# Altium schematic sheet STM32F051.SchDoc
size A4
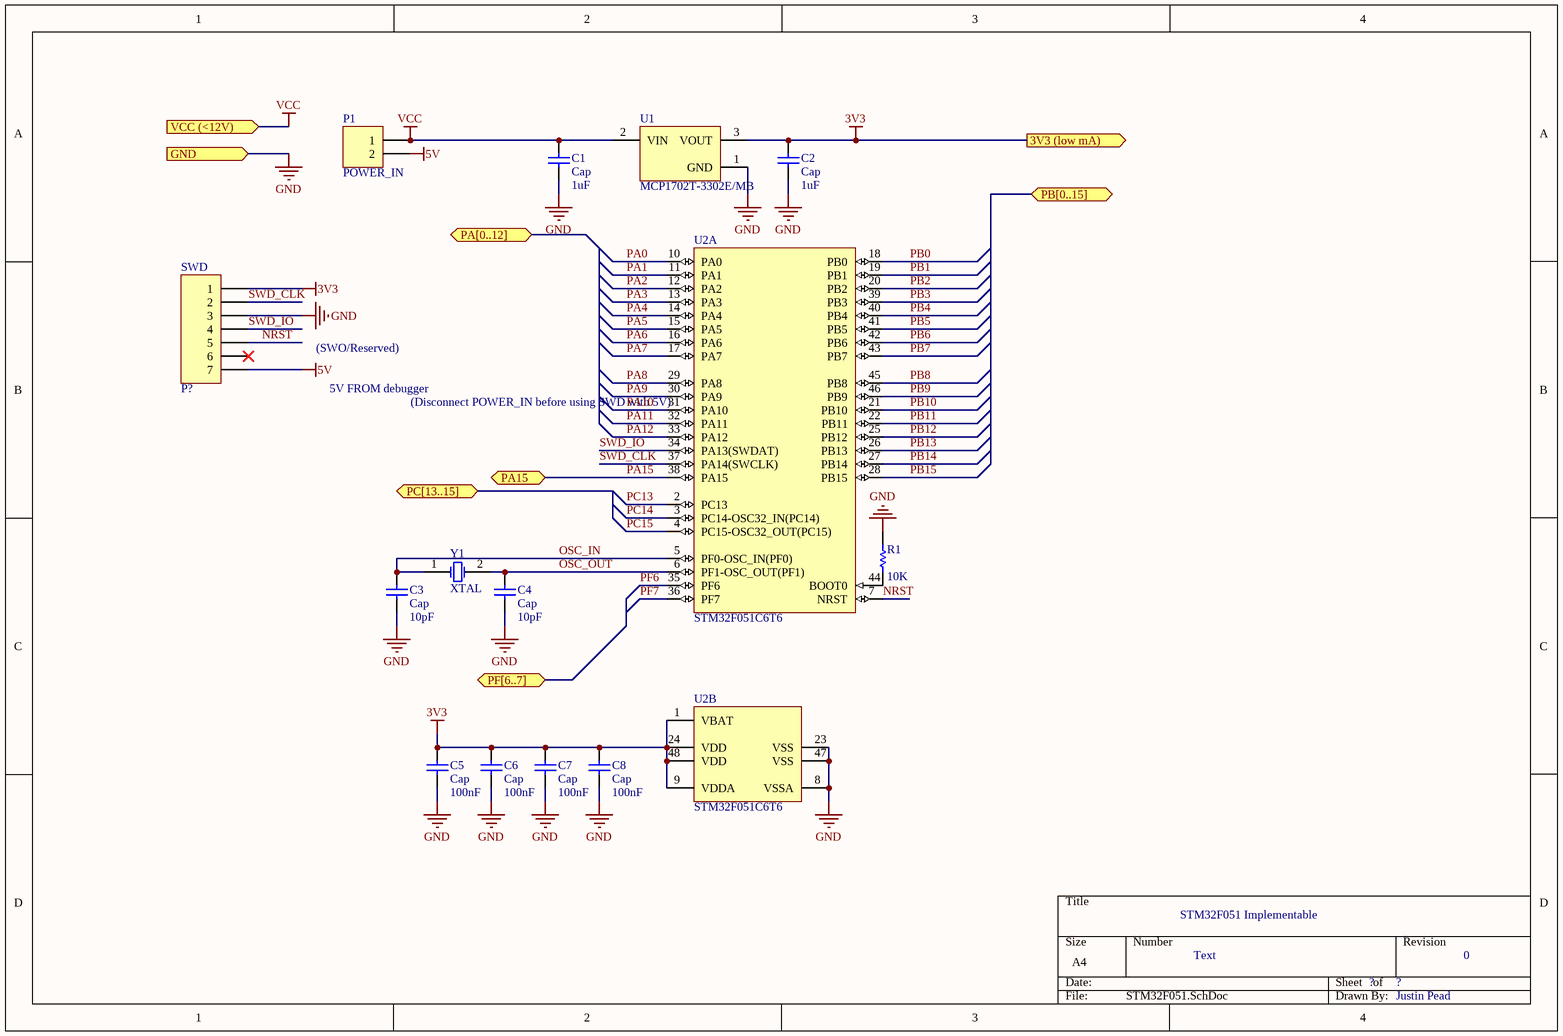
[diagram p0: STM32F051.SchDoc]

## Parts
C1  Cap  value 1uF  [0805_JG]
C2  Cap  value 1uF  [0805_JG]
C3  Cap  value 10pF  [0805_JG]
C4  Cap  value 10pF  [0805_JG]
C5  Cap  value 100nF  [0805_JG]
C6  Cap  value 100nF  [0805_JG]
C7  Cap  value 100nF  [0805_JG]
C8  Cap  value 100nF  [0805_JG]
P1  POWER_IN  [HDR1X2]
R1  value 10K  [0805_JG]  (hidden comment: Res1)
SWD  P?  [HDR1X7]
U1  MCP1702T-3302E/MB  [SOT-89-MB3_M]
U2  STM32F051C6T6  [STM-LQFP48_M]  (parts A,B of 2)
Y1  XTAL  [HC-49US]

## Ports
3V3 (low mA) (out), GND (in), PA15 (bidir), PA[0..12] (bidir), PB[0..15] (bidir), PC[13..15] (bidir), PF[6..7] (bidir), VCC (<12V) (in)

## Nets
3V3: C2.2 C5.2 C6.2 C7.2 C8.2 SWD.1 U1.3(VOUT) U2.1(VBAT) U2.9(VDDA) U2.24(VDD) U2.48(VDD) ; port 3V3 (low mA)
5V: P1.2 SWD.7
GND: C1.1 C2.1 C3.1 C4.1 C5.1 C6.1 C7.1 C8.1 R1.2 SWD.3 U1.1(GND) U2.8(VSSA) U2.23(VSS) U2.47(VSS) ; port GND
VCC: C1.2 P1.1 U1.2(VIN) ; port VCC (<12V)
NRST: SWD.5 U2.7(NRST)
OSC_IN: C3.2 U2.5(PF0-OSC_IN(PF0)) Y1.1(OSC1)
OSC_OUT: C4.2 U2.6(PF1-OSC_OUT(PF1)) Y1.2(OSC2)
PA0: U2.10(PA0)
PA1: U2.11(PA1)
PA2: U2.12(PA2)
PA3: U2.13(PA3)
PA4: U2.14(PA4)
PA5: U2.15(PA5)
PA6: U2.16(PA6)
PA7: U2.17(PA7)
PA8: U2.29(PA8)
PA9: U2.30(PA9)
PA10: U2.31(PA10)
PA11: U2.32(PA11)
PA12: U2.33(PA12)
PA15: U2.38(PA15) ; port PA15
PB0: U2.18(PB0)
PB1: U2.19(PB1)
PB2: U2.20(PB2)
PB3: U2.39(PB3)
PB4: U2.40(PB4)
PB5: U2.41(PB5)
PB6: U2.42(PB6)
PB7: U2.43(PB7)
PB8: U2.45(PB8)
PB9: U2.46(PB9)
PB10: U2.21(PB10)
PB11: U2.22(PB11)
PB12: U2.25(PB12)
PB13: U2.26(PB13)
PB14: U2.27(PB14)
PB15: U2.28(PB15)
PC13: U2.2(PC13)
PC14: U2.3(PC14-OSC32_IN(PC14))
PC15: U2.4(PC15-OSC32_OUT(PC15))
PF6: U2.35(PF6)
PF7: U2.36(PF7)
SWD_CLK: SWD.2 U2.37(PA14(SWCLK))
SWD_IO: SWD.4 U2.34(PA13(SWDAT))
NetR1_1: R1.1 U2.44(BOOT0)

Not connected (* = marked no-connect by the designer): SWD 6*

## Notes on the sheet
- (near SWD) (SWO/Reserved)
- (near SWD) 5V FROM debugger
- (near SWD) (Disconnect POWER_IN before using SWD with 5V)
- STM32F051 Implementable
- Text
- ?
- 0
- Justin Pead

## Library data of the parts
C1-C8 = Cap: Capacitor; Published: 8-Jun-2000; LatestRevisionDate: 17-Jul-2002; LatestRevisionNote: Re-released for DXP Platform.; PackageReference: RAD-0.3; Publisher: Altium Limited; PackageDescription: Radial Cap, Thru-Hole; 2 Leads; 0.3 in Pin Spacing
P1 = Header 2: Header, 2-Pin; LatestRevisionDate: 17-Jul-2002; LatestRevisionNote: Re-released for DXP Platform.; Publisher: Altium Limited
R1 = Res1: Resistor; Published: 8-Jun-2000; LatestRevisionDate: 17-Jul-2002; LatestRevisionNote: Re-released for DXP Platform.; PackageReference: AXIAL-0.3; Publisher: Altium Limited; PackageDescription: Axial Device, Thru-Hole; 2 Leads; 0.3 in Pin Spacing
SWD = Header 7: Header, 7-Pin; LatestRevisionDate: 17-Jul-2002; LatestRevisionNote: Re-released for DXP Platform.; Publisher: Altium Limited
U1 = CMP-0136-00851-1: 250 mA Low Quiescent Current LDO Regulator, 3-Pin SOT-89, Extended Temperature, Tape and Reel; PackageReference: SOT-89-MB3; DatasheetVersion: revD, Jun-2009; PackageDescription: 3-Lead Plastic Small Outline Transistor Header (MB) [SOT-89]; PackageVersion: revBB, Aug-2009; Code_IPC: SOT89
U2 = CMP-0304-00011-3: ARM Cortex-M0 32-bit MCU, 32 KB Flash, 4 KB Internal RAM, 39 I/Os, 48-pin LQFP, -40 to 85 degC, Tray; Internal RAM Size (kB): 4; Operating Frequency(F) (Processor speed) (MHz): 48; FLASH Size (Prog) (kB): 32; Supply Voltage(Vcc) min (V): 2; I/Os (High Current): 39; ComponentLink3URL: http://www.st.com/st-web-ui/static/active/en/resource/technical/document/datasheet/DM00058181.pdf; Mounting Technology: Surface Mount; PackageDescription: 48-Pin Low Profile Quad Flat Package, 7 x 7 mm Body, 0.5 mm Pitch; PackageReference: LQFP48; ComponentLink1Description: Manufacturer URL; ComponentLink1URL: http://www.st.com/web/en/home.html; Core: ARM Cortex-M0; ComponentLink2URL: http://www.st.com/st-web-ui/static/active/en/resource/technical/document/datasheet/DM00039193.pdf; PackageVersion: Rev. 6, 06/2013; ComponentLink2Description: Datasheet; PartNumber: STM32F051C6T6; ComponentLink3Description: Package Specification; Packing: Tray; DatasheetVersion: Rev. 3; PartId: 1
Y1 = XTAL: Crystal Oscillator; Published: 8-Jun-2000; LatestRevisionDate: 17-Jul-2002; LatestRevisionNote: Re-released for DXP Platform.; PackageReference: R38; Publisher: Altium Limited; PackageDescription: Crystal, Thru-Hole; 2 Leads; Body 3.1 x 8.2 mm (Dia.xH)